# Altium schematic sheet usb-wifi.SchDoc
size A4; SheetNumber: 1; SheetTotal: 1; SPICEModelCacheRFCSWZBE: <root> / <DocumentId>RFCSWZBE</DocumentId> / <CacheFrame Number="0"> / <Model Name="xtal" Kind="CKT"> / <Text>*Generic type:crystal pkg:HC33/51 / .SUBCKT XTAL 1 2 PARAMS: FREQ=1Meg RS=750 C=13pf Q=1000 / LX 1 3 {((Q*RS)/(6.2831852*FREQ))} IC=0.5M / CX 3 4 {(1/(Q*6.2831852*FREQ*RS))} / C0 1 2 {C} / RS 4 2 {RS} / .ENDS XTAL</Text> / </Model> / <Model Name="led0" Kind="MDL"> / <Text>*Typ INFRARED GaAs LED: Vf=1.2V Vr=5V If=40mA trr=3uS / *LED Pinout: 1=A, 2=K / .MODEL LED0 D (IS=93.5P RS=84M N=2.63 BV=5 IBV=10U / + CJO=2.97P VJ=.75 M=.333 TT=4.32U)</Text> / </Model> / </CacheFrame> / </root>
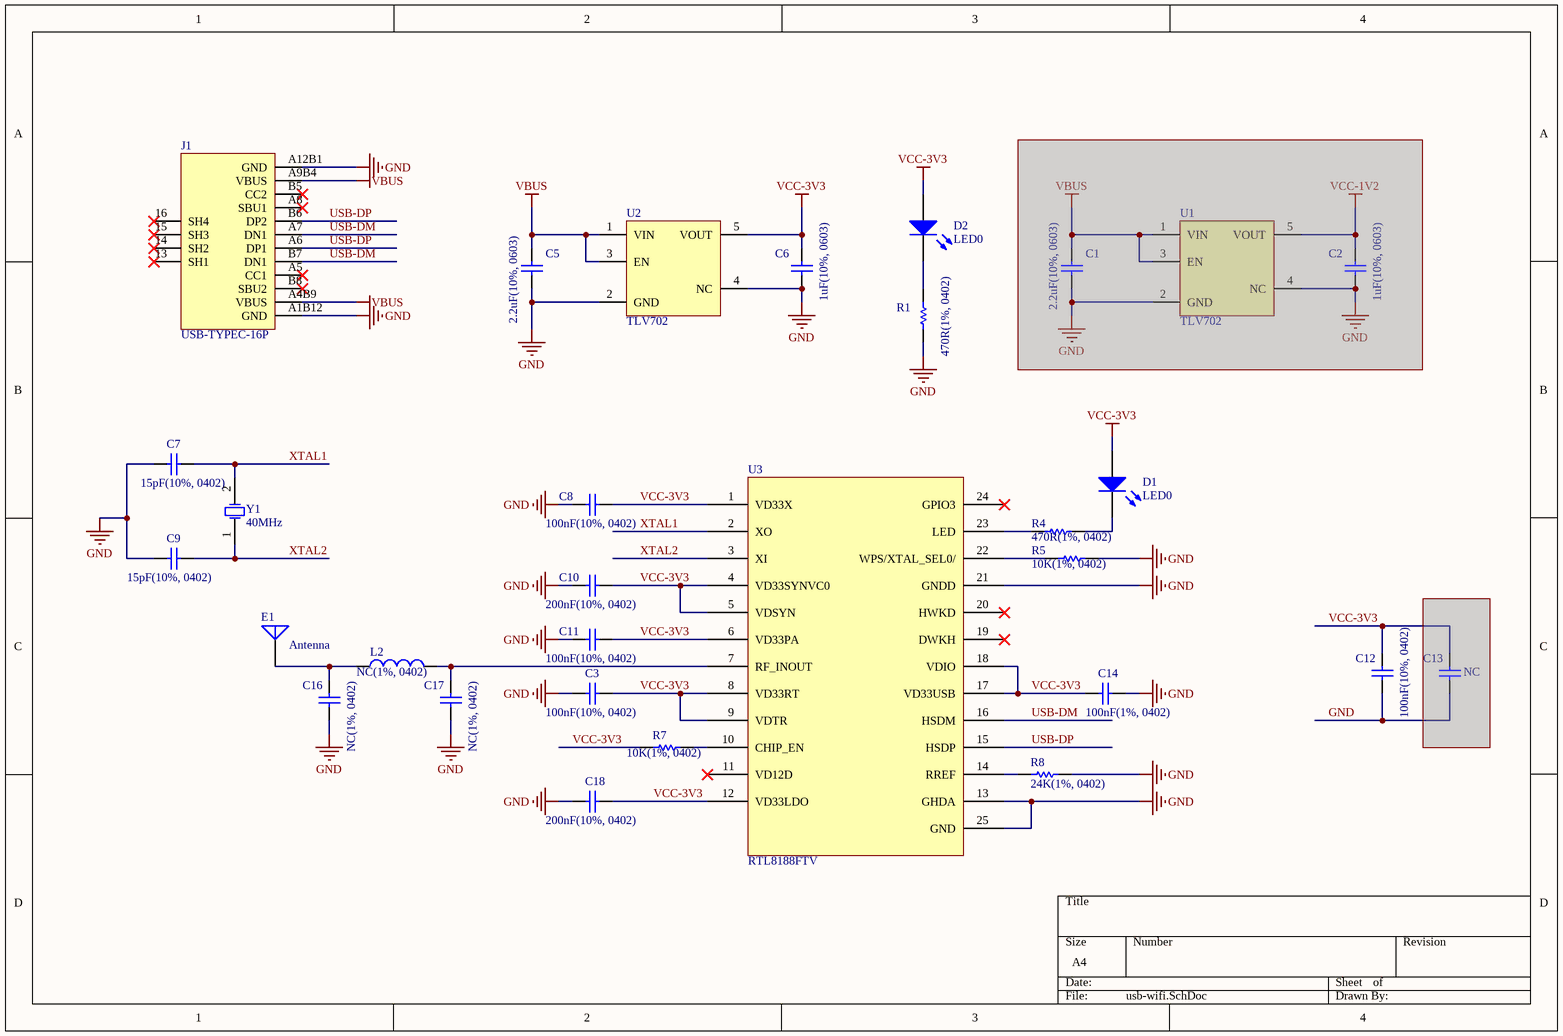
[diagram p0: usb-wifi.SchDoc]

## Parts
C1  2.2uF(10%, 0603)  [0603C]  (masked out: inside a compile mask, not in the netlist)
C2  1uF(10%, 0603)  [0603C]  (masked out: inside a compile mask, not in the netlist)
C3  100nF(10%, 0402)  [0402C]
C5  2.2uF(10%, 0603)  [0603C]
C6  1uF(10%, 0603)  [0603C]
C7  15pF(10%, 0402)  [0402C]
C8  100nF(10%, 0402)  [0402C]
C9  15pF(10%, 0402)  [0402C]
C10  200nF(10%, 0402)  [0402C]
C11  100nF(10%, 0402)  [0402C]
C12  100nF(10%, 0402)  [0402C]
C13  NC  [RAD-0.3]  (masked out: inside a compile mask, not in the netlist)
C14  100nF(1%, 0402)  [0402C]
C16  NC(1%, 0402)  [0402C]
C17  NC(1%, 0402)  [0402C]
C18  200nF(10%, 0402)  [0402C]
D1  LED0  [LED-0603]
D2  LED0  [LED-0603]
E1  Antenna  [Antenna]
J1  USB-TYPEC-16P  [USB-TYPEC-16P]
L2  NC(1%, 0402)  [0402-A]
R1  470R(1%, 0402)  [0603R]
R4  470R(1%, 0402)  [0402R]
R5  10K(1%, 0402)  [0402R]
R7  10K(1%, 0402)  [0402R]
R8  24K(1%, 0402)  [0402R]
U1  TLV702  [SOT23-5]  (masked out: inside a compile mask, not in the netlist)
U2  TLV702  [SOT23-5]
U3  RTL8188FTV  [QFN-4X4-24-EA3059]
Y1  40MHz  [SMD3225-4P]

## Nets
GND: C3.1 C5.1 C6.1 C7.1 C8.1 C9.1 C10.1 C11.1 C12.1 C14.2 C16.2 C17.1 C18.1 J1.A1B12(GND) J1.A12B1(GND) R1.1 R5.2 R8.2 U2.2(GND) U2.4(NC) U3.13(GHDA) U3.21(GNDD) U3.25(GND)
VBUS: C5.2 J1.A4B9(VBUS) J1.A9B4(VBUS) U2.1(VIN) U2.3(EN)
VCC-3V3: C3.2 C6.2 C8.2 C10.2 C11.2 C12.2 C14.1 C18.2 D1.1(A) D2.1(A) R7.1 U2.5(VOUT) U3.1(VD33X) U3.4(VD33SYNVC0) U3.5(VDSYN) U3.6(VD33PA) U3.8(VD33RT) U3.9(VDTR) U3.12(VD33LDO) U3.17(VD33USB) U3.18(VDIO)
USB-DM: J1.A7(DN1) J1.B7(DN1) U3.16(HSDM)
USB-DP: J1.A6(DP1) J1.B6(DP2) U3.15(HSDP)
XTAL1: C7.2 U3.2(XO) Y1.2(OSC2)
XTAL2: C9.2 U3.3(XI) Y1.1(OSC1)
NetC16_1: C16.1 E1.1(A) L2.1
NetC17_2: C17.2 L2.2 U3.7(RF_INOUT)
NetD1_2: D1.2(K) R4.2
NetD2_2: D2.2(K) R1.2
NetR4_1: R4.1 U3.23(LED)
NetR5_1: R5.1 U3.22(WPS/XTAL_SEL0/)
NetR7_2: R7.2 U3.10(CHIP_EN)
NetR8_1: R8.1 U3.14(RREF)

Not connected (* = marked no-connect by the designer): J1 13(SH1)* 14(SH2)* 15(SH3)* 16(SH4)* A5(CC1)* A8(SBU1)* B5(CC2)* B8(SBU2)*; U3 11(VD12D)* 19(DWKH)* 20(HWKD)* 24(GPIO3)*

## Library data of the parts
C1-C3 C5-C14 C16-C18 = Cap: Capacitor; Value: 100pF; Published: 8-Jun-2000; LatestRevisionDate: 17-Jul-2002; LatestRevisionNote: Re-released for DXP Platform.; PackageReference: RAD-0.3; Publisher: Altium Limited; PackageDescription: Radial Cap, Thru-Hole; 2 Leads; 0.3 in Pin Spacing
D1 D2 = LED0: Typical INFRARED GaAs LED; Published: 8-Jun-2000; LatestRevisionDate: 08-Jul-2005; LatestRevisionNote: Mech Layer 1 removed.; PackageReference: LED-0; Publisher: Altium Limited; PackageDescription: LED; 2 Leads
E1 = Antenna: Generic Antenna; Published: 24-Mar-1999; LatestRevisionDate: 17-Jul-2002; LatestRevisionNote: Re-released for DXP Platform.; PackageReference: PIN1; Publisher: Altium Limited
L2 = Inductor: Code_IEC: 1005; Value: 10mH; Published: 8-Jun-2000; LatestRevisionDate: 29-May-2009; LatestRevisionNote: IPC-7351 Footprint Added.; PackageReference: 0402-A; Publisher: Altium Limited; PackageDescription: Chip Inductor; Code_JEITA: 0402
R1 R4 R5 R7 R8 = Res1: Resistor; Value: 1K; Published: 8-Jun-2000; LatestRevisionDate: 17-Jul-2002; LatestRevisionNote: Re-released for DXP Platform.; PackageReference: AXIAL-0.3; Publisher: Altium Limited; PackageDescription: Axial Device, Thru-Hole; 2 Leads; 0.3 in Pin Spacing
U1 U2 = TLV702: TI LDO chip, max output current: 300mA, drapout=220mV
Y1 = XTAL: Crystal Oscillator; Published: 8-Jun-2000; LatestRevisionDate: 17-Jul-2002; LatestRevisionNote: Re-released for DXP Platform.; PackageReference: R38; Publisher: Altium Limited; PackageDescription: Crystal, Thru-Hole; 2 Leads; Body 3.1 x 8.2 mm (Dia.xH)